# Altium schematic sheet Ucus_Kontrol_Bilgisayari.SchDoc: AZAK ROKET TAKIMI ÖZGÜN UÇUŞ KONTROL BİLGİSAYARI (part 4 of 4)
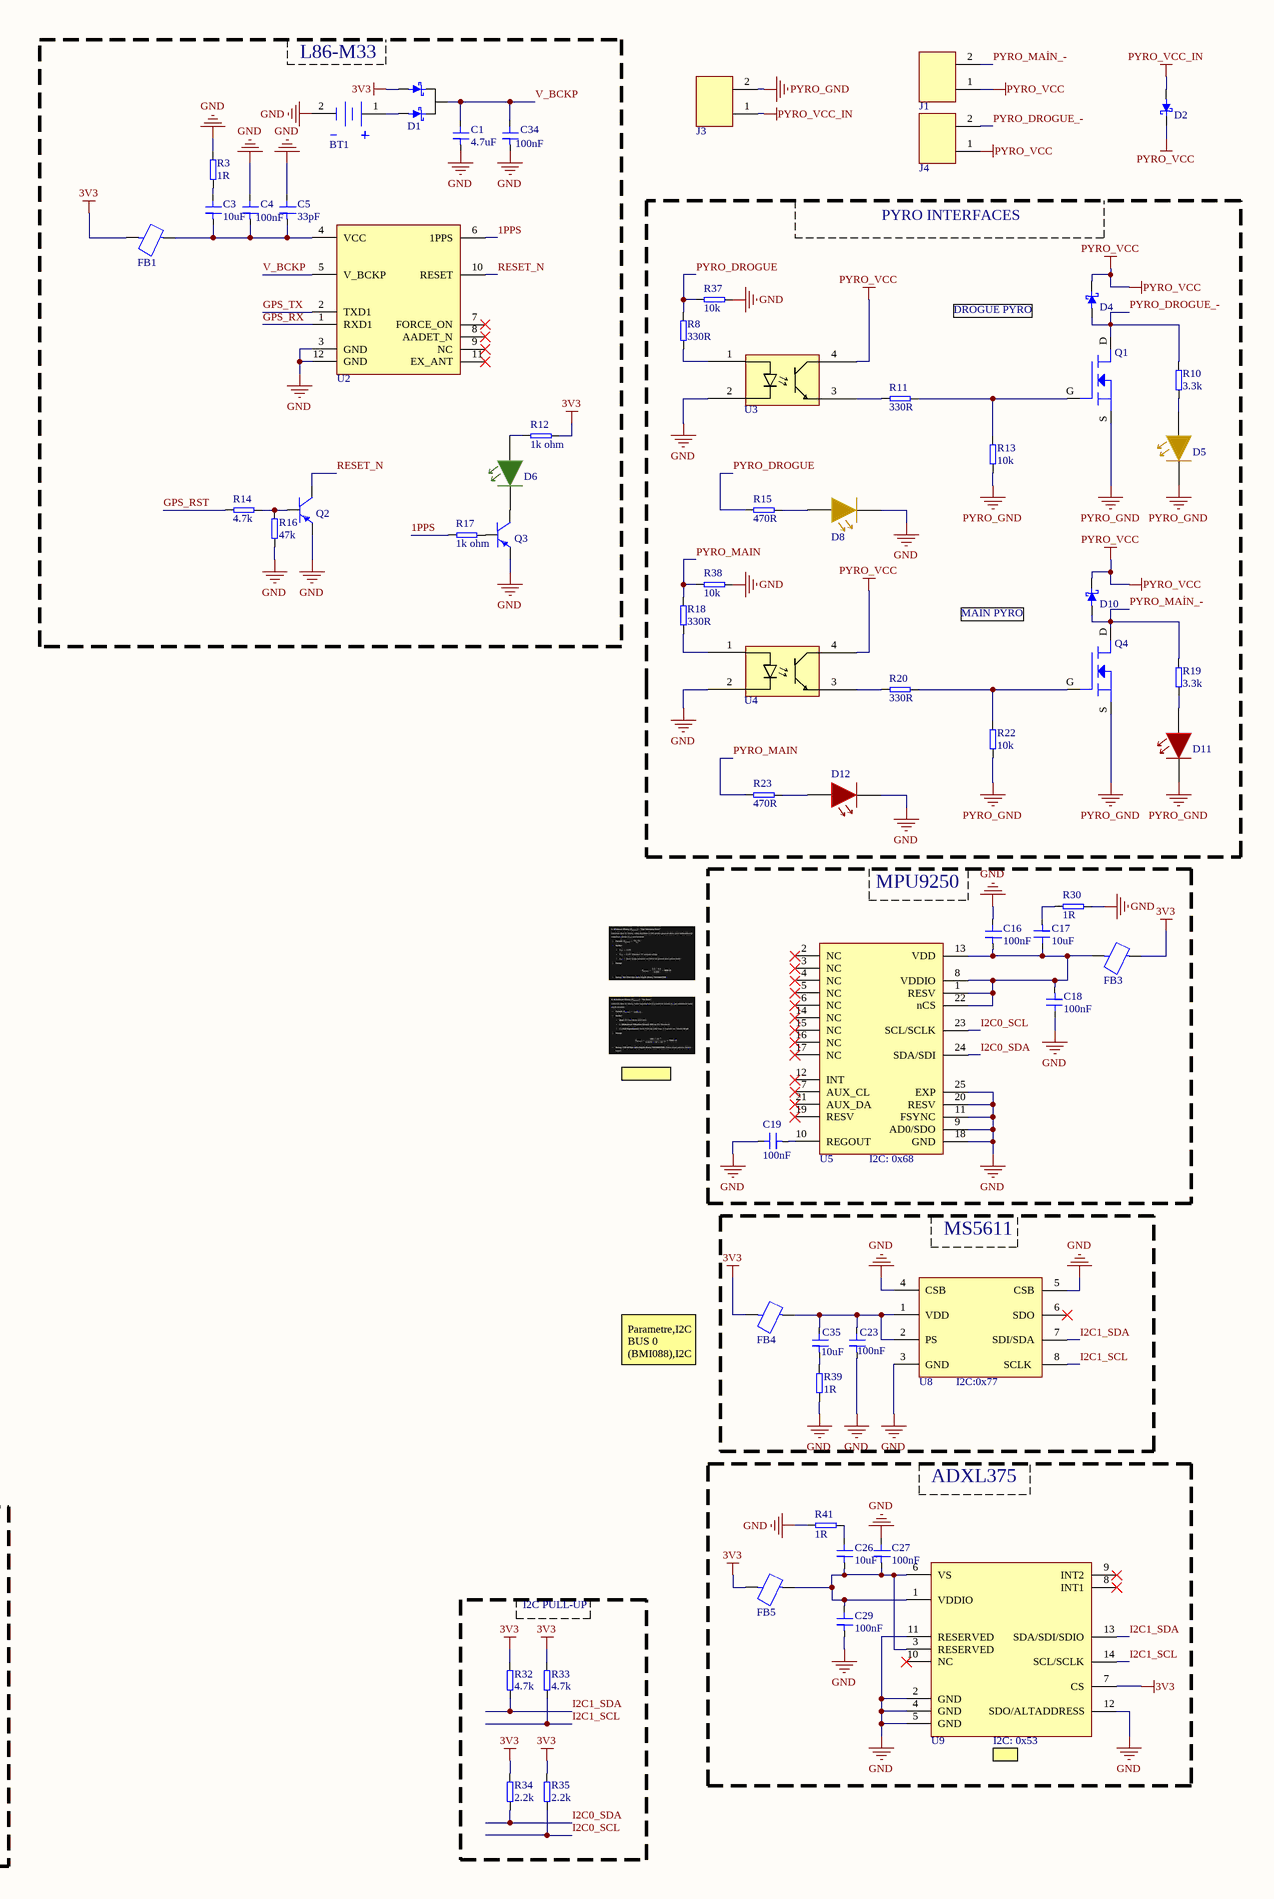
[diagram p4: Ucus_Kontrol_Bilgisayari.SchDoc, right]

## Library data of the parts (continued)
R14 R32 R33 = RES 4.7k Ohm %1 SMD 0603: Res Thick Film 1.6 x 0.8 mm 4.7K Ohm 1% 0.1W(1/10W) 100ppm/ C Molded SMD Paper T/R; Manufacturer: Yageo Group; Manufacturer Part Number: RC0603FR-074K7L; Power Dissipation: 100mW; Value: 4.7kΩ; Temperature Coefficient: 100ppm/°C; Voltage Rating: 75V; Voltage Rating (DC): 50V; Supplier: Mouser; Supplier Part Number: 603-RC0603FR-074K7L; RoHS: Compliant; Category: Chip SMD Resistors; Stock: 1189372; Pricing: 1=0,1, 10=0,009, 50=0,009, 100=0,008, 1000=0,006, 10000=0,002 (USD); Case/Package: 0603; Case Code (Imperial): 0603; China RoHS: Non-Compliant; Composition: Thick Film; Depth: 800µm; Height: 450µm; Lead Free: Lead Free; Lead Pitch: 300µm; Length: 1.6mm; Lifecycle Status: Production; Max Operating Temperature: 155°C; Military Standard: Not; Min Operating Temperature: -55°C; Mounting Technology: Surface Mount; Pins: 2; Number of Terminals: 2; Packaging: Tape & Reel; Power Rating: 100mW; REACH SVHC: Yes; Schedule B: 8533210045, 8533210045|8533210045|8533210045|8533210045|8533210045|8533210045|8533210045|8533210045|8533210045|8533210045|8533210045|8533210045|8533210045|8533210045|8533210045|8533210045|8533210045|8533210045|8533210045|8533210045|8533210045|8533210045|8533210045|85; Termination: SMD/SMT; Tolerance: 1%; Width: 800µm; Working Voltage: 75V; ComponentLink1URL: https://datasheet.octopart.com:443/RC0603FR-074K7L-Yageo-datasheet-175887523.pdf?src-supplier=IHS; ComponentLink1Description: https://datasheet.octopart.com:443/RC0603FR-074K7L-Yageo-datasheet-175887523.pdf?src-supplier=IHS; ComponentLink2URL: https://datasheet.octopart.com:443/RC0603FR-074K7L-Yageo-datasheet-103092701.pdf?src-supplier=Upverter; ComponentLink2Description: https://datasheet.octopart.com:443/RC0603FR-074K7L-Yageo-datasheet-103092701.pdf?src-supplier=Upverter; ComponentLink3URL: https://datasheet.octopart.com:443/RC0603FR-074K7L-Yageo-datasheet-8328172.pdf?src-supplier=Farnell; ComponentLink3Description: https://datasheet.octopart.com:443/RC0603FR-074K7L-Yageo-datasheet-8328172.pdf?src-supplier=Farnell; ComponentLink4URL: https://datasheet.octopart.com:443/RC0603FR-074K7L-Yageo-datasheet-13691069.pdf?src-supplier=Farnell; ComponentLink4Description: https://datasheet.octopart.com:443/RC0603FR-074K7L-Yageo-datasheet-13691069.pdf?src-supplier=Farnell; ComponentLink5URL: https://datasheet.octopart.com:443/RC0603FR-074K7L-Yageo-datasheet-175423674.pdf?src-supplier=Newark; ComponentLink5Description: https://datasheet.octopart.com:443/RC0603FR-074K7L-Yageo-datasheet-175423674.pdf?src-supplier=Newark; ComponentLink6URL: https://datasheet.octopart.com:443/RC0603FR-074K7L-Yageo-datasheet-12596169.pdf?src-supplier=Newark; ComponentLink6Description: https://datasheet.octopart.com:443/RC0603FR-074K7L-Yageo-datasheet-12596169.pdf?src-supplier=Newark; ComponentLink7URL: https://datasheet.octopart.com:443/RC0603FR-074K7L-Yageo-datasheet-503470.pdf?src-supplier=Newark; ComponentLink7Description: https://datasheet.octopart.com:443/RC0603FR-074K7L-Yageo-datasheet-503470.pdf?src-supplier=Newark; ComponentLink8URL: https://datasheet.octopart.com:443/RC0603FR-074K7L-Yageo-datasheet-34211833.pdf?src-supplier=element14+APAC; ComponentLink8Description: https://datasheet.octopart.com:443/RC0603FR-074K7L-Yageo-datasheet-34211833.pdf?src-supplier=element14+APAC; ComponentLink9URL: https://datasheet.octopart.com:443/RC0603FR-074K7L-Yageo-datasheet-62067350.pdf?src-supplier=element14+APAC; ComponentLink9Description: https://datasheet.octopart.com:443/RC0603FR-074K7L-Yageo-datasheet-62067350.pdf?src-supplier=element14+APAC; ComponentLink10URL: https://datasheet.octopart.com:443/RC0603FR-074K7L-Yageo-datasheet-17842380.pdf?src-supplier=element14+APAC; ComponentLink10Description: https://datasheet.octopart.com:443/RC0603FR-074K7L-Yageo-datasheet-17842380.pdf?src-supplier=element14+APAC; ComponentLink11URL: https://datasheet.octopart.com:443/RC0603FR-074K7L-Yageo-datasheet-164759695.pdf?src-supplier=Future+Electronics; ComponentLink11Description: https://datasheet.octopart.com:443/RC0603FR-074K7L-Yageo-datasheet-164759695.pdf?src-supplier=Future+Electronics; ComponentLink12URL: https://datasheet.octopart.com:443/RC0603FR-074K7L-Yageo-datasheet-137700087.pdf?src-supplier=Future+Electronics; ComponentLink12Description: https://datasheet.octopart.com:443/RC0603FR-074K7L-Yageo-datasheet-137700087.pdf?src-supplier=Future+Electronics; ComponentLink13URL: https://datasheet.octopart.com:443/RC0603FR074K7L-Yageo-datasheet-27584510.pdf?src-supplier=Future+Electronics; ComponentLink13Description: https://datasheet.octopart.com:443/RC0603FR074K7L-Yageo-datasheet-27584510.pdf?src-supplier=Future+Electronics; ComponentLink14URL: https://datasheet.octopart.com:443/RC0603FR-074K7L-Yageo-datasheet-15599030.pdf?src-supplier=Future+Electronics; ComponentLink14Description: https://datasheet.octopart.com:443/RC0603FR-074K7L-Yageo-datasheet-15599030.pdf?src-supplier=Future+Electronics; ComponentLink15URL: https://datasheet.octopart.com:443/RC0603FR-074K7L-Yageo-datasheet-79472498.pdf?src-supplier=Megastar; ComponentLink15Description: https://datasheet.octopart.com:443/RC0603FR-074K7L-Yageo-datasheet-79472498.pdf?src-supplier=Megastar; ComponentLink16URL: https://datasheet.octopart.com/RC0603FR-074K7L-Yageo-datasheet-73766026.pdf; ComponentLink16Description: https://datasheet.octopart.com/RC0603FR-074K7L-Yageo-datasheet-73766026.pdf; ComponentLink17URL: https://datasheet.octopart.com:443/RC0603FR-074K7L-Yageo-datasheet-118562.pdf?src-supplier=DigiKey; ComponentLink17Description: https://datasheet.octopart.com:443/RC0603FR-074K7L-Yageo-datasheet-118562.pdf?src-supplier=DigiKey; ComponentLink18URL: http://sigma.octopart.com:80/conflict_mineral_statement/Yageo-company-3.pdf?src-supplier=Compliance+Statements; ComponentLink18Description: http://sigma.octopart.com:80/conflict_mineral_statement/Yageo-company-3.pdf?src-supplier=Compliance+Statements; ComponentLink19URL: http://sigma.octopart.com:80/rohs_statement/Yageo-company-2.pdf?src-supplier=Compliance+Statements; ComponentLink19Description: http://sigma.octopart.com:80/rohs_statement/Yageo-company-2.pdf?src-supplier=Compliance+Statements; ComponentLink20Description: Tedarikçi; ComponentLink20URL: https://www.ozdisan.com/p/smt-smd-ve-cip-direncler-194/yageo-rc0603fr-074k7l-494590
R16 = RES 47k Ohm %5 SMD 0603: RES.(1608) 0603 47K Ohms 5% 1/10W-S 100PPM; Manufacturer: Royal Ohm; Manufacturer Part Number: 0603SAJ0473TDE; Supplier: Mouser; Supplier Part Number: 303-0603SAJ0473TDE; Category: Uncategorized; Pricing: 1=0,1, 10=0,006, 50=0,006, 100=0,003, 1000=0,002, 10000=0,001 (USD); ComponentLink1Description: Tedaarikçi; ComponentLink1URL: https://www.ozdisan.com/p/smt-smd-ve-cip-direncler-194/royalohm-0603saj0473tde-344193
R25 R26 = RES 5.1kOhm %1 SMD 0603: RES.(1608) 0603 5.1K Ohms 1% 1/10W-S 100PPM; Manufacturer: Royal Ohm; Manufacturer Part Number: 0603SAF5101T5E; Value: 5.1kΩ; Temperature Coefficient: 100ppm/°C; Supplier: Mouser; Supplier Part Number: 303-0603SAF5101T5E; Category: Uncategorized; Stock: 195000; Pricing: 10000=0,001 (USD); ComponentLink1URL: https://datasheet.octopart.com:443/0603SAF5101T5E-Royal-Ohm-datasheet-165785611.pdf?src-supplier=TME; ComponentLink1Description: https://datasheet.octopart.com:443/0603SAF5101T5E-Royal-Ohm-datasheet-165785611.pdf?src-supplier=TME; ComponentLink2URL: https://datasheet.octopart.com:443/0603SAF5101T5E-Royal-Ohm-datasheet-157855877.pdf?src-supplier=TME; ComponentLink2Description: https://datasheet.octopart.com:443/0603SAF5101T5E-Royal-Ohm-datasheet-157855877.pdf?src-supplier=TME; ComponentLink3URL: https://datasheet.octopart.com:443/0603SAF5101T5E-Royal-Ohm-datasheet-62069544.pdf?src-supplier=TME; ComponentLink3Description: https://datasheet.octopart.com:443/0603SAF5101T5E-Royal-Ohm-datasheet-62069544.pdf?src-supplier=TME; ComponentLink4URL: https://datasheet.octopart.com:443/0603SAF5101T5E-Royal-Ohm-datasheet-17591902.pdf?src-supplier=TME; ComponentLink4Description: https://datasheet.octopart.com:443/0603SAF5101T5E-Royal-Ohm-datasheet-17591902.pdf?src-supplier=TME; ComponentLink5Description: Tedarikçi; ComponentLink5URL: https://www.ozdisan.com/p/smt-smd-ve-cip-direncler-194/royalohm-0603saf5101t5e-352301
R28 R29 = RES 0R Ohms %1 SMD 0603: RES.(1608) 0603 0 Ohms 1% 1/10W; Manufacturer: VIKING; Manufacturer Part Number: CRT03F7-R0R0; Power Dissipation: 100mW; Value: 0Ω; Temperature Coefficient: 200ppm/°C; Voltage Rating: 50V; ComponentLink1Description: Tedarikçi; ComponentLink1URL: https://www.ozdisan.com/p/smt-smd-ve-cip-direncler-194/viking-crt03f7-r0r0-1077288; Supplier: Mouser; Supplier Part Number: CRT03F7-R0R0; RoHS: Compliant; Category: Chip SMD Resistors; Stock: 2093609; Pricing: 1=0,1, 1=0,086, 10=0,007, 10=0,006, 50=0,007, 100=0,005, 100=0,004, 1000=0,004, 1000=0,003, 5000=0,002, 10000=0,002 (USD); Case/Package: 0603; Case Code (Imperial): 0603; China RoHS: Non-Compliant; Composition: Thick Film; Contact Plating: Tin; Depth: 800µm; Height: 450µm; Lead Free: Lead Free; Length: 1.6mm; Lifecycle Status: Production; Max Operating Temperature: 155°C; Military Standard: Not; Min Operating Temperature: -55°C; Mounting Technology: Surface Mount; Pins: 2; Number of Terminals: 2; Packaging: Cut Tape; Power Rating: 100mW; Radiation Hardening: No; REACH SVHC: Yes; Termination: SMD/SMT; Tolerance: 1%; Voltage Rating (DC): 50V; Width: 800µm; ComponentLink2URL: https://datasheet.octopart.com:443/RC0603JR-070RL-Yageo-datasheet-182189538.pdf?src-supplier=IHS; ComponentLink2Description: https://datasheet.octopart.com:443/RC0603JR-070RL-Yageo-datasheet-182189538.pdf?src-supplier=IHS; ComponentLink3URL: https://datasheet.octopart.com:443/RC0603JR-070RL-Yageo-datasheet-8328172.pdf?src-supplier=element14+APAC; ComponentLink3Description: https://datasheet.octopart.com:443/RC0603JR-070RL-Yageo-datasheet-8328172.pdf?src-supplier=element14+APAC; ComponentLink4URL: https://datasheet.octopart.com:443/RC0603JR-070RL-Yageo-datasheet-17842380.pdf?src-supplier=element14+APAC; ComponentLink4Description: https://datasheet.octopart.com:443/RC0603JR-070RL-Yageo-datasheet-17842380.pdf?src-supplier=element14+APAC; ComponentLink5URL: https://datasheet.octopart.com:443/RC0603JR-070RL-Yageo-datasheet-62067350.pdf?src-supplier=Farnell; ComponentLink5Description: https://datasheet.octopart.com:443/RC0603JR-070RL-Yageo-datasheet-62067350.pdf?src-supplier=Farnell; ComponentLink6URL: https://datasheet.octopart.com:443/RC0603JR-070RL-Yageo-datasheet-15599030.pdf?src-supplier=Future+Electronics; ComponentLink6Description: https://datasheet.octopart.com:443/RC0603JR-070RL-Yageo-datasheet-15599030.pdf?src-supplier=Future+Electronics; ComponentLink7URL: https://datasheet.octopart.com:443/RC0603JR-070RL-Yageo-datasheet-164759695.pdf?src-supplier=Future+Electronics; ComponentLink7Description: https://datasheet.octopart.com:443/RC0603JR-070RL-Yageo-datasheet-164759695.pdf?src-supplier=Future+Electronics; ComponentLink8URL: https://datasheet.octopart.com:443/RC0603JR-070RL-Yageo-datasheet-137700087.pdf?src-supplier=Future+Electronics; ComponentLink8Description: https://datasheet.octopart.com:443/RC0603JR-070RL-Yageo-datasheet-137700087.pdf?src-supplier=Future+Electronics; ComponentLink9URL: https://datasheet.octopart.com:443/RC0603JR-070RL-Yageo-datasheet-27584510.pdf?src-supplier=Future+Electronics; ComponentLink9Description: https://datasheet.octopart.com:443/RC0603JR-070RL-Yageo-datasheet-27584510.pdf?src-supplier=Future+Electronics; ComponentLink10URL: https://datasheet.octopart.com:443/RC0603JR-070RL-Yageo-datasheet-503470.pdf?src-supplier=Future+Electronics; ComponentLink10Description: https://datasheet.octopart.com:443/RC0603JR-070RL-Yageo-datasheet-503470.pdf?src-supplier=Future+Electronics; ComponentLink11URL: https://datasheet.octopart.com:443/RC0603JR-070RL-Yageo-datasheet-12596169.pdf?src-supplier=Newark; ComponentLink11Description: https://datasheet.octopart.com:443/RC0603JR-070RL-Yageo-datasheet-12596169.pdf?src-supplier=Newark; ComponentLink12URL: https://datasheet.octopart.com:443/RC0603JR-070RL-Yageo-datasheet-34211833.pdf?src-supplier=Newark; ComponentLink12Description: https://datasheet.octopart.com:443/RC0603JR-070RL-Yageo-datasheet-34211833.pdf?src-supplier=Newark; ComponentLink13URL: https://datasheet.octopart.com:443/RC0603JR-070RL-Yageo-datasheet-79472498.pdf?src-supplier=Megastar; ComponentLink13Description: https://datasheet.octopart.com:443/RC0603JR-070RL-Yageo-datasheet-79472498.pdf?src-supplier=Megastar; ComponentLink14URL: https://datasheet.octopart.com/RC0603JR-070RL-Yageo-datasheet-73766026.pdf; ComponentLink14Description: https://datasheet.octopart.com/RC0603JR-070RL-Yageo-datasheet-73766026.pdf; ComponentLink15URL: https://datasheet.octopart.com:443/RC0603JR-070RL-Yageo-datasheet-5393049.pdf?src-supplier=element14; ComponentLink15Description: https://datasheet.octopart.com:443/RC0603JR-070RL-Yageo-datasheet-5393049.pdf?src-supplier=element14; ComponentLink16URL: https://datasheet.octopart.com:443/RC0603JR-070RL-Yageo-datasheet-118562.pdf?src-supplier=DigiKey; ComponentLink16Description: https://datasheet.octopart.com:443/RC0603JR-070RL-Yageo-datasheet-118562.pdf?src-supplier=DigiKey; ComponentLink17URL: http://sigma.octopart.com:80/conflict_mineral_statement/Yageo-company-3.pdf?src-supplier=Compliance+Statements; ComponentLink17Description: http://sigma.octopart.com:80/conflict_mineral_statement/Yageo-company-3.pdf?src-supplier=Compliance+Statements; ComponentLink18URL: http://sigma.octopart.com:80/rohs_statement/Yageo-company-2.pdf?src-supplier=Compliance+Statements; ComponentLink18Description: http://sigma.octopart.com:80/rohs_statement/Yageo-company-2.pdf?src-supplier=Compliance+Statements
R34 R35 = RES 2.2k Ohm %1 SMD 0603: Res Thick Film 0603 2.2K Ohm 1% 0.1W(1/10W) +/-100ppm/C Epoxy Pad SMD T/R; Manufacturer: Yageo Group; Manufacturer Part Number: RC0603FR-072K2L; Max Power Dissipation: 100mW; Value: 2.2kΩ; Temperature Coefficient: 100ppm/°C; Voltage Rating: 75V; Voltage Rating (DC): 50V; Supplier: Mouser; Supplier Part Number: 603-RC0603FR-072K2L; RoHS: Compliant; Category: Chip SMD Resistors; Stock: 1388232; Pricing: 1=0,1, 10=0,007, 50=0,007, 100=0,006, 1000=0,006, 10000=0,002 (USD); Case/Package: 0603; Case Code (Imperial): 0603; Case Code (Metric): 0603; China RoHS: Non-Compliant; Composition: Thick Film; Depth: 800µm; Features: Moisture Resistant; Height: 450µm; Lead Free: Lead Free; Length: 1.6mm; Lifecycle Status: Production; Max Operating Temperature: 155°C; Military Standard: Not; Min Operating Temperature: -55°C; Mounting Technology: Surface Mount; Pins: 2; Number of Terminals: 2; Number of Terminations: 2; Packaging: Tape & Reel; Power Dissipation: 100mW; Power Rating: 100mW; REACH SVHC: Yes; Schedule B: 8533210045, 8533210045|8533210045|8533210045|8533210045|8533210045|8533210045|8533210045|8533210045|8533210045|8533210045|8533210045|8533210045|8533210045|8533210045|8533210045, 8533210045|8533210045|8533210045|8533210045|8533210045|8533210045|8533210045|8533210045|8533210045|8533210045|8533210045|8533210045|8533210045|8533210045|8533210045|8533210045, 8533210045|8533210045|8533210045|8533210045|8533210045|8533210045|8533210045|8533210045|8533210045|8533210045|8533210045|8533210045|8533210045|8533210045|8533210045|8533210045|8533210045; Termination: SMD/SMT; Tolerance: 1%; Width: 800µm; Working Voltage: 75V; ComponentLink1URL: https://datasheet.octopart.com:443/RC0603FR-072K2L-Yageo-datasheet-175887523.pdf?src-supplier=IHS; ComponentLink1Description: https://datasheet.octopart.com:443/RC0603FR-072K2L-Yageo-datasheet-175887523.pdf?src-supplier=IHS; ComponentLink2URL: https://datasheet.octopart.com:443/RC0603FR-072K2L-Yageo-datasheet-103092701.pdf?src-supplier=Upverter; ComponentLink2Description: https://datasheet.octopart.com:443/RC0603FR-072K2L-Yageo-datasheet-103092701.pdf?src-supplier=Upverter; ComponentLink3URL: https://datasheet.octopart.com:443/RC0603FR-072K2L-Yageo-datasheet-8328172.pdf?src-supplier=Newark; ComponentLink3Description: https://datasheet.octopart.com:443/RC0603FR-072K2L-Yageo-datasheet-8328172.pdf?src-supplier=Newark; ComponentLink4URL: https://datasheet.octopart.com:443/RC0603FR-072K2L-Yageo-datasheet-12596169.pdf?src-supplier=Newark; ComponentLink4Description: https://datasheet.octopart.com:443/RC0603FR-072K2L-Yageo-datasheet-12596169.pdf?src-supplier=Newark; ComponentLink5URL: https://datasheet.octopart.com:443/RC0603FR-072K2L-Yageo-datasheet-13691069.pdf?src-supplier=Newark; ComponentLink5Description: https://datasheet.octopart.com:443/RC0603FR-072K2L-Yageo-datasheet-13691069.pdf?src-supplier=Newark; ComponentLink6URL: https://datasheet.octopart.com:443/RC0603FR-072K2L-Yageo-datasheet-34211833.pdf?src-supplier=element14+APAC; ComponentLink6Description: https://datasheet.octopart.com:443/RC0603FR-072K2L-Yageo-datasheet-34211833.pdf?src-supplier=element14+APAC; ComponentLink7URL: https://datasheet.octopart.com:443/RC0603FR-072K2L-Yageo-datasheet-62067350.pdf?src-supplier=element14+APAC; ComponentLink7Description: https://datasheet.octopart.com:443/RC0603FR-072K2L-Yageo-datasheet-62067350.pdf?src-supplier=element14+APAC; ComponentLink8URL: https://datasheet.octopart.com:443/RC0603FR-072K2L-Yageo-datasheet-17842380.pdf?src-supplier=element14+APAC; ComponentLink8Description: https://datasheet.octopart.com:443/RC0603FR-072K2L-Yageo-datasheet-17842380.pdf?src-supplier=element14+APAC; ComponentLink9URL: https://datasheet.octopart.com:443/RC0603FR-072K2L-Yageo-datasheet-21426514.pdf?src-supplier=element14+APAC; ComponentLink9Description: https://datasheet.octopart.com:443/RC0603FR-072K2L-Yageo-datasheet-21426514.pdf?src-supplier=element14+APAC; ComponentLink10URL: https://datasheet.octopart.com:443/RC0603FR-072K2L-Yageo-datasheet-164759695.pdf?src-supplier=Future+Electronics; ComponentLink10Description: https://datasheet.octopart.com:443/RC0603FR-072K2L-Yageo-datasheet-164759695.pdf?src-supplier=Future+Electronics; ComponentLink11URL: https://datasheet.octopart.com:443/RC0603FR-072K2L-Yageo-datasheet-137700087.pdf?src-supplier=Future+Electronics; ComponentLink11Description: https://datasheet.octopart.com:443/RC0603FR-072K2L-Yageo-datasheet-137700087.pdf?src-supplier=Future+Electronics; ComponentLink12URL: https://datasheet.octopart.com:443/RC0603FR-072K2L-Yageo-datasheet-27584510.pdf?src-supplier=Future+Electronics; ComponentLink12Description: https://datasheet.octopart.com:443/RC0603FR-072K2L-Yageo-datasheet-27584510.pdf?src-supplier=Future+Electronics; ComponentLink13URL: https://datasheet.octopart.com:443/RC0603FR-072K2L-Yageo-datasheet-15599030.pdf?src-supplier=Future+Electronics; ComponentLink13Description: https://datasheet.octopart.com:443/RC0603FR-072K2L-Yageo-datasheet-15599030.pdf?src-supplier=Future+Electronics; ComponentLink14URL: https://datasheet.octopart.com:443/RC0603FR-072K2L-Yageo-datasheet-8324193.pdf?src-supplier=Future+Electronics; ComponentLink14Description: https://datasheet.octopart.com:443/RC0603FR-072K2L-Yageo-datasheet-8324193.pdf?src-supplier=Future+Electronics; ComponentLink15URL: https://datasheet.octopart.com:443/RC0603FR-072K2L-Yageo-datasheet-79472498.pdf?src-supplier=Megastar; ComponentLink15Description: https://datasheet.octopart.com:443/RC0603FR-072K2L-Yageo-datasheet-79472498.pdf?src-supplier=Megastar; ComponentLink16URL: https://datasheet.octopart.com/RC0603FR-072K2L-Yageo-datasheet-73766026.pdf; ComponentLink16Description: https://datasheet.octopart.com/RC0603FR-072K2L-Yageo-datasheet-73766026.pdf; ComponentLink17URL: https://datasheet.octopart.com:443/RC0603FR-072K2L-Yageo-datasheet-118562.pdf?src-supplier=DigiKey; ComponentLink17Description: https://datasheet.octopart.com:443/RC0603FR-072K2L-Yageo-datasheet-118562.pdf?src-supplier=DigiKey; ComponentLink18URL: https://datasheet.octopart.com:443/RC0603FR-072K2L-Yageo-datasheet-499455.pdf?src-supplier=element14; ComponentLink18Description: https://datasheet.octopart.com:443/RC0603FR-072K2L-Yageo-datasheet-499455.pdf?src-supplier=element14; ComponentLink19URL: http://sigma.octopart.com:80/conflict_mineral_statement/Yageo-company-3.pdf?src-supplier=Compliance+Statements; ComponentLink19Description: http://sigma.octopart.com:80/conflict_mineral_statement/Yageo-company-3.pdf?src-supplier=Compliance+Statements; ComponentLink20URL: http://sigma.octopart.com:80/rohs_statement/Yageo-company-2.pdf?src-supplier=Compliance+Statements; ComponentLink20Description: http://sigma.octopart.com:80/rohs_statement/Yageo-company-2.pdf?src-supplier=Compliance+Statements
SW1 SW2 = L-KLS7-TS3611-2.5-180-T: Boyut: 3.65x6.1x2.5mm; Akım Değeri (DC): 50 mA; Voltaj Değeri (DC): 12 V; ComponentLink1Description: Tedarikçi; ComponentLink1URL: https://www.ozdisan.com/p/tact-sivicler-485/kls-electronic-l-kls7-ts3611-2-5-180-t-466204?srsltid=AfmBOorFLjm9ymzcBd8UOG7X3jKp1KxBP6-EelnuiW7FwuRcnv0FOZ8-&=tact-sivicler-485&=kls-electronic-l-kls7-ts3611-2-5-180-t-466204; Part Number: L-KLS7-TS3611-2.5-180-T; Çalıştırma Kuvveti: 180 gF
U1 = AP64500SP-13: 3.8V to 40V Input 5A Low IQ Synchronous Buck Converter with Programmable Frequency 8-Pin SOIC EP T/R; Manufacturer: Diodes Inc.; Max Switching Frequency: 2.2MHz; Min Output Voltage: 800mV; Nominal Supply Voltage: 12V; Number of Circuits: 1; Supplier: Mouser; Supplier Part Number: 621-AP64500SP-13; Manufacturer Part Number: AP64500SP-13; RoHS: Compliant; Category: Voltage Regulators - Switching; Stock: 11720; Pricing: 1=2,09, 10=1,55, 50=1,41, 100=1,26, 1000=1,11, 10000=1,11 (USD); China RoHS: Compliant; Height - Seated (Max): 1.63mm; Length: 4.9mm; Lifecycle Status: Production; Max Supply Voltage: 40V; Max Operating Temperature: 85°C; Max Output current: 5A; Max Output Voltage: 40V; Min Input Voltage: 3.8V; Min Operating Temperature: -40°C; Number of Terminals: 8; REACH SVHC: Yes; Schedule B: 8542390000, 8542390000|8542390000|8542390000|8542390000|8542390000; Terminal Pitch: 1.27mm; Topology: Buck; Width: 3.9mm; ComponentLink1URL: https://datasheet.octopart.com:443/AP64500SP-13-Diodes-Inc.-datasheet-149521345.pdf?src-supplier=IHS; ComponentLink1Description: https://datasheet.octopart.com:443/AP64500SP-13-Diodes-Inc.-datasheet-149521345.pdf?src-supplier=IHS; ComponentLink2URL: https://datasheet.octopart.com:443/AP64500SP-13-Diodes-Inc.-datasheet-145012329.pdf?src-supplier=Diodes+Inc+SCT; ComponentLink2Description: https://datasheet.octopart.com:443/AP64500SP-13-Diodes-Inc.-datasheet-145012329.pdf?src-supplier=Diodes+Inc+SCT; ComponentLink3URL: https://sigma.octopart.com:443/138896280/technical_drawing/Diodes-Inc.-AP64500SP-13.pdf?src-supplier=Diodes+Inc+SCT; ComponentLink3Description: https://sigma.octopart.com:443/138896280/technical_drawing/Diodes-Inc.-AP64500SP-13.pdf?src-supplier=Diodes+Inc+SCT; ComponentLink4Description: Tedarikçi; ComponentLink4URL: https://www.e-komponent.com/buck-switching-regulator-ic-ap64500sp-13
U2 = L86-M33: GLONASS/GPS/QZSS Module 18, 4x18, 4x6, 4mm SMD w/Antenna L86-M33; Manufacturer: Quectel Wireless Solutions; Designed by: Eren/Mehmet; Supplier: Mouser; Supplier Part Number: 277-L86-M33; Manufacturer Part Number: L86-M33; RoHS: Yes; Category: Connectors; Stock: 3077; Pricing: 1=15,26, 10=11,88, 50=10,54, 100=9,69, 1000=8,44, 10000=8,44 (USD); ComponentLink1URL: http://www.quectel.com/UploadFile/Product/Quectel_L86_GNSS_Specification_V1.0.pdf?src-supplier=Avnet; ComponentLink1Description: http://www.quectel.com/UploadFile/Product/Quectel_L86_GNSS_Specification_V1.0.pdf?src-supplier=Avnet; ComponentLink2URL: https://datasheet.octopart.com/L86-M33-Quectel-datasheet-163887215.pdf?src-supplier=SOS+electronic; ComponentLink2Description: https://datasheet.octopart.com/L86-M33-Quectel-datasheet-163887215.pdf?src-supplier=SOS+electronic
U3 U4 = LTV-816S-TA1-C: Transistor Output Optocoupler, 1-Element, 5000V Isolation; Manufacturer: Lite-On; Collector Emitter Breakdown Voltage: 80V; Current Transfer Ratio: 200%; Dark Current: 100nA; Forward Current: 50mA; Forward Voltage: 1.4V; Isolation Voltage: 5kV; Max Power Dissipation: 150mW; Number of Elements: 1; Supplier: Mouser; Supplier Part Number: 859-LTV-816S-TA1-C; Manufacturer Part Number: LTV-816S-TA1-C; RoHS: Compliant; Category: Optocouplers; Stock: 2386; Pricing: 1=0,39, 10=0,265, 50=0,265, 100=0,189, 1000=0,135, 10000=0,103 (USD); China RoHS: Compliant; Lifecycle Status: Production; Max Operating Temperature: 110°C; Min Operating Temperature: -30°C; Mounting Technology: Surface Mount; REACH SVHC: Yes; Schedule B: 8541408000, 8541408000|8541408000|8541408000|8541408000|8541408000; ComponentLink1URL: https://datasheet.octopart.com:443/LTV-816S-TA1-C-Lite-On-datasheet-147640660.pdf?src-supplier=IHS; ComponentLink1Description: https://datasheet.octopart.com:443/LTV-816S-TA1-C-Lite-On-datasheet-147640660.pdf?src-supplier=IHS; ComponentLink2URL: https://datasheet.octopart.com:443/LTV-816S-TA1-C-Lite-On-datasheet-136482132.pdf?src-supplier=Future+Electronics; ComponentLink2Description: https://datasheet.octopart.com:443/LTV-816S-TA1-C-Lite-On-datasheet-136482132.pdf?src-supplier=Future+Electronics; ComponentLink3Description: Tedarikçi; ComponentLink3URL: https://www.ozdisan.com/p/transistor-ve-fotovoltaik-cikisli-optokuplorler-189/liteon-ltv-816s-ta1-c-359059
U5 = MPU9250: Accelerometer, Gyroscope, Magnetometer, 9 Axis Sensor I2C, SPI Output; Supplier Device Package: 24-QFN (3x3); Package / Case: 24-TFQFN Module Exposed Pad; Operating Temperature: -40°C ~ 85°C; Output Type: I2C, SPI; Sensor Type: Accelerometer, Gyroscope, Magnetometer, 9 Axis
U6 = ESP32-S3-WROOM-1U-N16R8: Module; Wi-Fi/Bluetooth; transceiver; 16MB FLASH/8MB PSRAM/512KB SRAM/384KB ROM; 3.0-3.6V; 18x25.5x3.2mm; Manufacturer: Espressif Systems; Max Supply Voltage: 3.6V; Min Supply Voltage: 3V; Operating Supply Voltage: 3.3V; Supplier: Mouser; Supplier Part Number: 356-ESP32S3WM1UN16R8; Manufacturer Part Number: ESP32-S3-WROOM-1U-N16R8; RoHS: Compliant; Category: RF Transceiver Modules and Modems; Stock: 12610; Pricing: 1=6,56, 1=5,64, 10=5,69, 10=4,89, 25=4,63, 50=5,38, 100=4,96, 100=4,27, 250=4,04, 500=3,35, 1000=3,89, 10000=3,89 (USD); Height - Seated (Max): 3.35mm; Length: 19.2mm; Max Operating Temperature: 65°C; Min Operating Temperature: -40°C; Number of Terminals: 41; REACH SVHC: Yes; Terminal Pitch: 1.27mm; Width: 18mm; ComponentLink1URL: https://datasheet.octopart.com:443/ESP32-S3-WROOM-1U-N16R8-Espressif-Systems-datasheet-165560563.pdf?src-supplier=IHS; ComponentLink1Description: https://datasheet.octopart.com:443/ESP32-S3-WROOM-1U-N16R8-Espressif-Systems-datasheet-165560563.pdf?src-supplier=IHS; ComponentLink2URL: https://datasheet.octopart.com:443/ESP32-S3-WROOM-1U-N16R8-Espressif-Systems-datasheet-188867343.pdf?src-supplier=TME; ComponentLink2Description: https://datasheet.octopart.com:443/ESP32-S3-WROOM-1U-N16R8-Espressif-Systems-datasheet-188867343.pdf?src-supplier=TME; ComponentLink3URL: https://datasheet.octopart.com:443/ESP32-S3-WROOM-1U-N16R8-Espressif-Systems-datasheet-165560559.pdf?src-supplier=TME; ComponentLink3Description: https://datasheet.octopart.com:443/ESP32-S3-WROOM-1U-N16R8-Espressif-Systems-datasheet-165560559.pdf?src-supplier=TME; ComponentLink4Description: Tedarikçi; ComponentLink4URL: https://www.e-komponent.com/esp32-s3-wroom-1u-n16r8-transceiver-module
U7 = USBLC6-2SC6: STMicroelectronics USBLC6-2SC6 TVS diode surge protection on full tape reel; Breakdown Voltage: 6V; Value: 2.5pF; Clamping Voltage: 17V; Data Rate: 480Mbps; Direction: Unidirectional; Element Configuration: Dual; ESD Protection: Yes; Forward Voltage: 1.1V; Leakage Current: 150nA; Max Junction Temperature (Tj): 125°C; Max Repetitive Reverse Voltage (Vrrm): 5.25V; Number of Bidirectional Channels: 2; Number of Elements: 1; Peak Pulse Current: 5A; Reverse Standoff Voltage: 5V; Test Current: 1mA; Supplier: Mouser; Supplier Part Number: 511-USBLC6-2SC6; Manufacturer: STMicroelectronics; Manufacturer Part Number: USBLC6-2SC6; RoHS: Compliant; Category: TVS Diodes; Stock: 219137; Pricing: 1=0,36, 1=0,31, 10=0,243, 10=0,209, 50=0,243, 100=0,163, 100=0,14, 500=0,109, 1000=0,114, 1000=0,098, 3000=0,068, 10000=0,075 (USD); Case/Package: SOT-23; China RoHS: Compliant; Contact Plating: Tin; Depth: 1.75mm; Height: 1.45mm; Lead Free: Lead Free; Length: 3.05mm; Lifecycle Status: Production; Max Breakdown Voltage: 6V; Max Operating Temperature: 125°C; Max Reverse Leakage Current: 150nA; Min Breakdown Voltage: 6V; Min Operating Temperature: -40°C; Mounting Technology: Surface Mount; Number of Channels: 2; Pins: 6; Number of Terminals: 6; Operating Supply Voltage: 1.1V; Peak Reverse Current: 150nA; Polarity: Unidirectional; Power Line Protection: Yes; Radiation Hardening: No; REACH SVHC: Yes; Reverse Breakdown Voltage: 6V; Schedule B: 8536300000, 8536300000|8536300000|8536300000|8536300000|8536300000|8536300000|8536300000|8536300000|8536300000|8536300000|8536300000|8536300000|8536300000|8536300000|8536300000|8536300000|8536300000|8536300000|8536300000|8536300000|8536300000|8536300000|8536300000|85; Termination: SMD/SMT; Width: 1.75mm; Working Voltage: 5V; ComponentLink1URL: https://datasheet.octopart.com:443/USBLC6-2SC6-STMicroelectronics-datasheet-10412581.pdf?src-supplier=Newark; ComponentLink1Description: https://datasheet.octopart.com:443/USBLC6-2SC6-STMicroelectronics-datasheet-10412581.pdf?src-supplier=Newark; ComponentLink2URL: https://datasheet.octopart.com:443/USBLC6-2SC6-STMicroelectronics-datasheet-181961833.pdf?src-supplier=Newark; ComponentLink2Description: https://datasheet.octopart.com:443/USBLC6-2SC6-STMicroelectronics-datasheet-181961833.pdf?src-supplier=Newark; ComponentLink3URL: https://datasheet.octopart.com:443/USBLC6-2SC6-STMicroelectronics-datasheet-525477.pdf?src-supplier=Factory+Futures; ComponentLink3Description: https://datasheet.octopart.com:443/USBLC6-2SC6-STMicroelectronics-datasheet-525477.pdf?src-supplier=Factory+Futures; ComponentLink4URL: https://datasheet.octopart.com:443/USBLC6-2SC6-STMicroelectronics-datasheet-82998616.pdf?src-supplier=Farnell; ComponentLink4Description: https://datasheet.octopart.com:443/USBLC6-2SC6-STMicroelectronics-datasheet-82998616.pdf?src-supplier=Farnell; ComponentLink5URL: https://datasheet.octopart.com:443/USBLC6-2SC6-STMicroelectronics-datasheet-46285.pdf?src-supplier=Farnell; ComponentLink5Description: https://datasheet.octopart.com:443/USBLC6-2SC6-STMicroelectronics-datasheet-46285.pdf?src-supplier=Farnell; ComponentLink6URL: https://datasheet.octopart.com:443/USBLC6-2SC6-STMicroelectronics-datasheet-14050643.pdf?src-supplier=iiiC; ComponentLink6Description: https://datasheet.octopart.com:443/USBLC6-2SC6-STMicroelectronics-datasheet-14050643.pdf?src-supplier=iiiC; ComponentLink7URL: https://datasheet.octopart.com:443/USBLC6-2SC6-STMicroelectronics-datasheet-10521292.pdf?src-supplier=Jameco; ComponentLink7Description: https://datasheet.octopart.com:443/USBLC6-2SC6-STMicroelectronics-datasheet-10521292.pdf?src-supplier=Jameco; ComponentLink8Description: Tedarikçi; ComponentLink8URL: https://www.ozdisan.com/p/tvs-diyotlar-386/stm-usblc6-2sc6-402751
U8 = MS5611: Pressure Sensor 1.44V to 3.6V 0.01bar to 1.2bar Absolute 8-Pin QFN T/R; Manufacturer: TE Connectivity; Manufacturer Part Number: MS561101BA03-50; Designed by: Eren/Mehmet; Output Type: SPI,I2C; Operating Pressure: 17.4PSI; Port Style: No Port; Max Pressure: 87.02PSI; ComponentLink1URL: http://www.farnell.com/datasheets/2917208.pdf?src-supplier=Farnell; ComponentLink1Description: http://www.farnell.com/datasheets/2917208.pdf?src-supplier=Farnell; ComponentLink2URL: http://www.farnell.com/datasheets/1756128.pdf?src-supplier=Newark; ComponentLink2Description: http://www.farnell.com/datasheets/1756128.pdf?src-supplier=Newark; ComponentLink3URL: https://www.te.com/commerce/DocumentDelivery/DDEController?Action=srchrtrv&DocNm=MS5611-01BA03&DocType=Data+Sheet&DocLang=English&src-supplier=Digikey; ComponentLink3Description: https://www.te.com/commerce/DocumentDelivery/DDEController?Action=srchrtrv&DocNm=MS5611-01BA03&DocType=Data+Sheet&DocLang=English&src-supplier=Digikey; ComponentLink4URL: https://datasheet.octopart.com/MS561101BA03-50-TE-Connectivity-datasheet-21074432.pdf?src-supplier=Element14; ComponentLink4Description: https://datasheet.octopart.com/MS561101BA03-50-TE-Connectivity-datasheet-21074432.pdf?src-supplier=Element14; ComponentLink5URL: https://datasheet.octopart.com/MS561101BA03-50-TE-Connectivity-datasheet-65793092.pdf?src-supplier=Future+Electronics; ComponentLink5Description: https://datasheet.octopart.com/MS561101BA03-50-TE-Connectivity-datasheet-65793092.pdf?src-supplier=Future+Electronics; ComponentLink6URL: https://datasheet.octopart.com/MS561101BA03-50-TE-Connectivity-datasheet-134530980.pdf?src-supplier=Master+Electronics; ComponentLink6Description: https://datasheet.octopart.com/MS561101BA03-50-TE-Connectivity-datasheet-134530980.pdf?src-supplier=Master+Electronics; Supplier: Mouser; Supplier Part Number: 824-MS561101BA03-50; RoHS: Yes; Category: Linear ICs; Pricing: 1=9,36, 10=8,23, 50=7,39, 100=6,27, 1000=5,83, 10000=5,78 (USD); Case/Package: SMD/SMT; Pins: 8; Min Operating Temperature: -40°C; Max Operating Temperature: 85°C; Operating Supply Voltage: 3.6V; Pressure Type: Absolute; Termination: SMD/SMT; Series: -; Packaging: Cut Tape; RoHS Compliant: Yes
U9 = ADXL375: 3-Axis, ±200 g Digital MEMS Accelerometer; Manufacturer: Analog Devices; Manufacturer Part Number: ADXL375BCCZ-RL7; Manufacturer Lifecycle Status: PRODUCTION; Axis: X, Y, Z; Bandwidth: 1kHz; Interface: I2C, SPI; Max Supply Voltage: 3.6V; Min Supply Voltage: 2V; Nominal Supply Current: 145µA; Supplier: Mouser; Supplier Part Number: 584-ADXL375BCCZ-RL7; RoHS: Compliant; Category: Accelerometers; Stock: 1898; Pricing: 1=12,41, 10=10,84, 50=9,98, 100=9,71, 1000=8,53, 10000=8,53 (USD); -3db Bandwidth: 1.6kHz; Height: 1mm; Lead Free: Contains Lead; Lifecycle Status: Production; Max Operating Temperature: 85°C; Min Operating Temperature: -40°C; Mounting Technology: Surface Mount; Pins: 14; Operating Supply Current: 145µA; Operating Supply Voltage: 3.6V; Output Type: Digital; Schedule B: 9031808080, 9031808080|9031808080, 9031808080|9031808080|9031808080, 9031808080|9031808080|9031808080|9031808080; ComponentLink1URL: https://datasheet.octopart.com:443/ADXL375BCCZ-RL7-Analog-Devices-datasheet-25360144.pdf?src-supplier=Upverter; ComponentLink1Description: https://datasheet.octopart.com:443/ADXL375BCCZ-RL7-Analog-Devices-datasheet-25360144.pdf?src-supplier=Upverter; ComponentLink2URL: https://sigma.octopart.com:443/160772067/technical_drawing/Analog-Devices-ADXL375BCCZ-RL7.pdf?src-supplier=Upverter; ComponentLink2Description: https://sigma.octopart.com:443/160772067/technical_drawing/Analog-Devices-ADXL375BCCZ-RL7.pdf?src-supplier=Upverter; ComponentLink3URL: https://octopart.com:443/opatz8j6/c1?t=y9lmieeWgZ9elonZMqrXmIgn_IZsCVo8rtjxFU3VdZOR9Mubp89NzcM6__QsSLf8-dk5RRem-joszf8SEqvilfxrCB11iJqw5X9Arqhy7foRDbxp7StnTURm-tdV4woioiKila_JmxNohQ1lxyaA81AyhAik26ysYEZVEJpWSThFjz-NCDmBVt5X3tIH7dM-gI1NAsoDzk0W8AgdiDQWEwn1k__uj5AtHdVkFjPmsxReUFzEGPjBJUFrTTW1zOLQllgZJ-oCJB7k7FVN_YjP1V3N53E_3ZgpfR7hpYibbar93OxYLElSpA&src-supplier=Analog+Devices; ComponentLink3Description: https://octopart.com:443/opatz8j6/c1?t=y9lmieeWgZ9elonZMqrXmIgn_IZsCVo8rtjxFU3VdZOR9Mubp89NzcM6__QsSLf8-dk5RRem-joszf8SEqvilfxrCB11iJqw5X9Arqhy7foRDbxp7StnTURm-tdV4woioiKila_JmxNohQ1lxyaA81AyhAik26ysYEZVEJpWSThFjz-NCDmBVt5X3tIH7dM-gI1NAsoDzk0W8AgdiDQWEwn1k__uj5AtHdVkFjPmsxReUFzEGPjBJUFrTTW1zOLQllgZJ-oCJB7k7FVN_YjP1V3N53E_3ZgpfR7hpYibbar93OxYLElSpA&src-supplier=Analog+Devices; ComponentLink4URL: https://datasheet.octopart.com:443/ADXL375BCCZ-RL7-Analog-Devices-datasheet-20674032.pdf?src-supplier=Analog+Devices; ComponentLink4Description: https://datasheet.octopart.com:443/ADXL375BCCZ-RL7-Analog-Devices-datasheet-20674032.pdf?src-supplier=Analog+Devices; ComponentLink5URL: https://datasheet.octopart.com:443/ADXL375BCCZ-RL7-Analog-Devices-datasheet-17332620.pdf?src-supplier=Analog+Devices; ComponentLink5Description: https://datasheet.octopart.com:443/ADXL375BCCZ-RL7-Analog-Devices-datasheet-17332620.pdf?src-supplier=Analog+Devices; ComponentLink6URL: https://datasheet.octopart.com:443/ADXL375BCCZ-RL7-Analog-Devices-datasheet-165827030.pdf?src-supplier=element14+APAC; ComponentLink6Description: https://datasheet.octopart.com:443/ADXL375BCCZ-RL7-Analog-Devices-datasheet-165827030.pdf?src-supplier=element14+APAC; ComponentLink7URL: http://sigma.octopart.com:80/conflict_mineral_statement/Analog-Devices-company-33.pdf?src-supplier=Compliance+Statements; ComponentLink7Description: http://sigma.octopart.com:80/conflict_mineral_statement/Analog-Devices-company-33.pdf?src-supplier=Compliance+Statements; ComponentLink8URL: https://octopart.com:443/opatz8j6/c1?t=rrkhkGPMjP7Iqnly7j9fdZ3o0RKgMiFkQPZMKbQbflJH--ggn13ri6nr_qoLoVMBpcjMsLuBtCN49j0RsZIoHqFD1kJUG9JuBPBVbRduVapR_ewwugjojTiNN3yLkHfsLl0bNk-eQFqtbX2ur4W2RAEfWZ7Ia_jJXVQqEje7Qe3hZpTAyumUSu6k56QI7byZ6hhDN9TYorEiHcCBnp2owL7n_reby6yXnIcmds1MrI-dxLJFVmAyu8Aezh2W6njhBZ_kNSSabPsoIz0Y_WQ7WW8OHftr-BLWyukyQKzirtU7K6zjNiW53g&src-supplier=Compliance+Statements; ComponentLink8Description: https://octopart.com:443/opatz8j6/c1?t=rrkhkGPMjP7Iqnly7j9fdZ3o0RKgMiFkQPZMKbQbflJH--ggn13ri6nr_qoLoVMBpcjMsLuBtCN49j0RsZIoHqFD1kJUG9JuBPBVbRduVapR_ewwugjojTiNN3yLkHfsLl0bNk-eQFqtbX2ur4W2RAEfWZ7Ia_jJXVQqEje7Qe3hZpTAyumUSu6k56QI7byZ6hhDN9TYorEiHcCBnp2owL7n_reby6yXnIcmds1MrI-dxLJFVmAyu8Aezh2W6njhBZ_kNSSabPsoIz0Y_WQ7WW8OHftr-BLWyukyQKzirtU7K6zjNiW53g&src-supplier=Compliance+Statements; ComponentLink9Description: Tedarikçi; ComponentLink9URL: https://www.digikey.com/en/products/detail/analog-devices-inc/ADXL375BCCZ/4376342
U10 = MAX3232IPWR: IC, Transceiver, RS232 (2)Transmitters/(2)Receivers, 250Kbit, TSSOP-16, -40C to +85C; Manufacturer: Texas Instruments; Manufacturer Lifecycle Status: ACTIVE; Data Rate: 250kbps; Logic Function: Receiver, Transceiver; Max Supply Voltage: 5.5V; Min Supply Voltage: 3V; Nominal Supply Current: 1mA; Number of Channels: 2; Number of Transceivers: 1; Operating Supply Voltage: 5V; Simplex/Duplex: Full Duplex; Supplier: Mouser; Supplier Part Number: 595-MAX3232IPWR; Manufacturer Part Number: MAX3232IPWR; RoHS: Compliant; Category: Interface ICs; Stock: 28054; Pricing: 1=1,01, 10=0,727, 50=0,655, 100=0,576, 1000=0,497, 10000=0,453 (USD); Case/Package: TSSOP; Height: 1.2mm; Lead Free: Lead Free; Length: 5mm; Lifecycle Status: Production; Max Operating Temperature: 85°C; Min Operating Temperature: -40°C; Mounting Technology: Surface Mount; Number of Drivers: 2; Pins: 16; Number of Receivers: 2; Number of Transmitters: 2; Operating Supply Current: 1mA; Packaging: Tape & Reel; Radiation Hardening: No; REACH SVHC: No; Schedule B: 8542390000, 8542390000|8542390000|8542390000|8542390000|8542390000; Thickness: 1mm; Weight: 61.887009mg; Width: 4.4mm; ComponentLink1URL: https://sigma.octopart.com:443/189718192/technical_drawing/Texas-Instruments-MAX3232IPWR.pdf?src-supplier=Texas+Instruments; ComponentLink1Description: https://sigma.octopart.com:443/189718192/technical_drawing/Texas-Instruments-MAX3232IPWR.pdf?src-supplier=Texas+Instruments; ComponentLink2URL: https://octopart.com:443/opatz8j6/c1?t=rNJkzVGHD8QDESG7XFNYsykgZEXUadFzzSMEgguNs1rZGPxKglcLcGakB1eP8ry9gbz37LCUPk4Or5ulQnPuUz3Y22sGolGdcJPpgEWnA8Cb41z-NyDpToWMZW0KsUvePjnzuBHDzGTKjcgNB-yr4Cl0kQf1s50b8VLI24CtTbroaGwR9zj9CxwfzApYZs7CQrSoI-cD-RxlcwOcRTkpTVjrq9Zdbk9vWa-ku9GiiqC5h0p_j6VvlpHTPx-rg0uH67WRaBHzhkyD_ylEnYOIEJ7swG900WshtT5QNVrZijW_U1PZghQYJbR9hvJzOqeaBLMD45U-x6SDBL7Unmks7BGFJYqn6QeZmJAnSMHKUihIxthuN9Zi6Y2aPs9zcrZCKwix&src-supplier=Texas+Instruments; ComponentLink2Description: https://octopart.com:443/opatz8j6/c1?t=rNJkzVGHD8QDESG7XFNYsykgZEXUadFzzSMEgguNs1rZGPxKglcLcGakB1eP8ry9gbz37LCUPk4Or5ulQnPuUz3Y22sGolGdcJPpgEWnA8Cb41z-NyDpToWMZW0KsUvePjnzuBHDzGTKjcgNB-yr4Cl0kQf1s50b8VLI24CtTbroaGwR9zj9CxwfzApYZs7CQrSoI-cD-RxlcwOcRTkpTVjrq9Zdbk9vWa-ku9GiiqC5h0p_j6VvlpHTPx-rg0uH67WRaBHzhkyD_ylEnYOIEJ7swG900WshtT5QNVrZijW_U1PZghQYJbR9hvJzOqeaBLMD45U-x6SDBL7Unmks7BGFJYqn6QeZmJAnSMHKUihIxthuN9Zi6Y2aPs9zcrZCKwix&src-supplier=Texas+Instruments; ComponentLink3URL: https://sigma.octopart.com:443/116621398/technical_drawing/Texas-Instruments-MAX3232IPWR.pdf?src-supplier=Texas+Instruments; ComponentLink3Description: https://sigma.octopart.com:443/116621398/technical_drawing/Texas-Instruments-MAX3232IPWR.pdf?src-supplier=Texas+Instruments; ComponentLink4URL: https://datasheet.octopart.com:443/MAX3232IPWR-Texas-Instruments-datasheet-41216554.pdf?src-supplier=Texas+Instruments; ComponentLink4Description: https://datasheet.octopart.com:443/MAX3232IPWR-Texas-Instruments-datasheet-41216554.pdf?src-supplier=Texas+Instruments; ComponentLink5URL: https://datasheet.octopart.com:443/MAX3232IPWR-Texas-Instruments-datasheet-36834620.pdf?src-supplier=Texas+Instruments; ComponentLink5Description: https://datasheet.octopart.com:443/MAX3232IPWR-Texas-Instruments-datasheet-36834620.pdf?src-supplier=Texas+Instruments; ComponentLink6URL: https://datasheet.octopart.com:443/MAX3232IPWR-Texas-Instruments-datasheet-22123331.pdf?src-supplier=Texas+Instruments; ComponentLink6Description: https://datasheet.octopart.com:443/MAX3232IPWR-Texas-Instruments-datasheet-22123331.pdf?src-supplier=Texas+Instruments; ComponentLink7URL: https://datasheet.octopart.com:443/MAX3232IPWR-Texas-Instruments-datasheet-11828648.pdf?src-supplier=Texas+Instruments; ComponentLink7Description: https://datasheet.octopart.com:443/MAX3232IPWR-Texas-Instruments-datasheet-11828648.pdf?src-supplier=Texas+Instruments; ComponentLink8URL: https://datasheet.octopart.com:443/MAX3232IPWR-Texas-Instruments-datasheet-10670759.pdf?src-supplier=Texas+Instruments; ComponentLink8Description: https://datasheet.octopart.com:443/MAX3232IPWR-Texas-Instruments-datasheet-10670759.pdf?src-supplier=Texas+Instruments; ComponentLink9URL: https://datasheet.octopart.com:443/MAX3232IPWR-Texas-Instruments-datasheet-10254354.pdf?src-supplier=Texas+Instruments; ComponentLink9Description: https://datasheet.octopart.com:443/MAX3232IPWR-Texas-Instruments-datasheet-10254354.pdf?src-supplier=Texas+Instruments; ComponentLink10URL: https://sigma.octopart.com:443/49249815/technical_drawing/Texas-Instruments-MAX3232IPWR.pdf?src-supplier=Texas+Instruments; ComponentLink10Description: https://sigma.octopart.com:443/49249815/technical_drawing/Texas-Instruments-MAX3232IPWR.pdf?src-supplier=Texas+Instruments; ComponentLink11URL: https://datasheet.octopart.com:443/MAX3232IPWR-Texas-Instruments-datasheet-8828700.pdf?src-supplier=Farnell; ComponentLink11Description: https://datasheet.octopart.com:443/MAX3232IPWR-Texas-Instruments-datasheet-8828700.pdf?src-supplier=Farnell; ComponentLink12URL: https://datasheet.octopart.com:443/MAX3232IPWR-Texas-Instruments-datasheet-8734276.pdf?src-supplier=Farnell; ComponentLink12Description: https://datasheet.octopart.com:443/MAX3232IPWR-Texas-Instruments-datasheet-8734276.pdf?src-supplier=Farnell; ComponentLink13URL: https://datasheet.octopart.com:443/MAX3232IPWR-Texas-Instruments-datasheet-8527338.pdf?src-supplier=Farnell; ComponentLink13Description: https://datasheet.octopart.com:443/MAX3232IPWR-Texas-Instruments-datasheet-8527338.pdf?src-supplier=Farnell; ComponentLink14URL: https://datasheet.octopart.com:443/MAX3232IPWR-Texas-Instruments-datasheet-611903.pdf?src-supplier=Farnell; ComponentLink14Description: https://datasheet.octopart.com:443/MAX3232IPWR-Texas-Instruments-datasheet-611903.pdf?src-supplier=Farnell; ComponentLink15URL: https://datasheet.octopart.com:443/MAX3232IPWR-Texas-Instruments-datasheet-37563965.pdf?src-supplier=Farnell; ComponentLink15Description: https://datasheet.octopart.com:443/MAX3232IPWR-Texas-Instruments-datasheet-37563965.pdf?src-supplier=Farnell; ComponentLink16URL: https://datasheet.octopart.com:443/MAX3232IPWR-Texas-Instruments-datasheet-26576805.pdf?src-supplier=Farnell; ComponentLink16Description: https://datasheet.octopart.com:443/MAX3232IPWR-Texas-Instruments-datasheet-26576805.pdf?src-supplier=Farnell; ComponentLink17URL: https://datasheet.octopart.com:443/MAX3232IPWR-Texas-Instruments-datasheet-23768451.pdf?src-supplier=Farnell; ComponentLink17Description: https://datasheet.octopart.com:443/MAX3232IPWR-Texas-Instruments-datasheet-23768451.pdf?src-supplier=Farnell; ComponentLink18URL: https://datasheet.octopart.com:443/MAX3232IPWR.-Texas-Instruments-datasheet-62342776.pdf?src-supplier=element14+APAC; ComponentLink18Description: https://datasheet.octopart.com:443/MAX3232IPWR.-Texas-Instruments-datasheet-62342776.pdf?src-supplier=element14+APAC; ComponentLink19URL: https://datasheet.octopart.com:443/MAX3232IPWR.-Texas-Instruments-datasheet-62088785.pdf?src-supplier=element14+APAC; ComponentLink19Description: https://datasheet.octopart.com:443/MAX3232IPWR.-Texas-Instruments-datasheet-62088785.pdf?src-supplier=element14+APAC; ComponentLink20URL: https://datasheet.octopart.com:443/MAX3232IPWR-Texas-Instruments-datasheet-14436492.pdf?src-supplier=Future+Electronics; ComponentLink20Description: https://datasheet.octopart.com:443/MAX3232IPWR-Texas-Instruments-datasheet-14436492.pdf?src-supplier=Future+Electronics; ComponentLink21URL: https://datasheet.octopart.com:443/MAX3232IPWR-Texas-Instruments-datasheet-137316104.pdf?src-supplier=Future+Electronics; ComponentLink21Description: https://datasheet.octopart.com:443/MAX3232IPWR-Texas-Instruments-datasheet-137316104.pdf?src-supplier=Future+Electronics; ComponentLink22URL: https://datasheet.octopart.com:443/MAX3232IPWR-Texas-Instruments-datasheet-165804188.pdf?src-supplier=LCSC; ComponentLink22Description: https://datasheet.octopart.com:443/MAX3232IPWR-Texas-Instruments-datasheet-165804188.pdf?src-supplier=LCSC; ComponentLink23URL: https://datasheet.octopart.com:443/MAX3232IPWR-Texas-Instruments-datasheet-159115493.pdf?src-supplier=LCSC; ComponentLink23Description: https://datasheet.octopart.com:443/MAX3232IPWR-Texas-Instruments-datasheet-159115493.pdf?src-supplier=LCSC; ComponentLink24URL: https://datasheet.octopart.com:443/MAX3232IPWR-Texas-Instruments-datasheet-164415690.pdf?src-supplier=SHENGYU+ELECTRONICS; ComponentLink24Description: https://datasheet.octopart.com:443/MAX3232IPWR-Texas-Instruments-datasheet-164415690.pdf?src-supplier=SHENGYU+ELECTRONICS; ComponentLink25URL: https://datasheet.octopart.com:443/MAX3232IPWR-Texas-Instruments-datasheet-20860975.pdf?src-supplier=Newark; ComponentLink25Description: https://datasheet.octopart.com:443/MAX3232IPWR-Texas-Instruments-datasheet-20860975.pdf?src-supplier=Newark; ComponentLink26URL: https://datasheet.octopart.com:443/MAX3232IPWR-Texas-Instruments-datasheet-14121419.pdf?src-supplier=iiiC; ComponentLink26Description: https://datasheet.octopart.com:443/MAX3232IPWR-Texas-Instruments-datasheet-14121419.pdf?src-supplier=iiiC; ComponentLink27URL: https://datasheet.octopart.com:443/MAX3232IPWR-Texas-Instruments-datasheet-10502933.pdf?src-supplier=Jameco; ComponentLink27Description: https://datasheet.octopart.com:443/MAX3232IPWR-Texas-Instruments-datasheet-10502933.pdf?src-supplier=Jameco; ComponentLink28URL: https://datasheet.octopart.com:443/MAX3232IPWR-Texas-Instruments-datasheet-153559.pdf?src-supplier=Mouser; ComponentLink28Description: https://datasheet.octopart.com:443/MAX3232IPWR-Texas-Instruments-datasheet-153559.pdf?src-supplier=Mouser; ComponentLink29URL: https://datasheet.octopart.com:443/MAX3232IPWR-Texas-Instruments-datasheet-5793.pdf?src-supplier=DigiKey; ComponentLink29Description: https://datasheet.octopart.com:443/MAX3232IPWR-Texas-Instruments-datasheet-5793.pdf?src-supplier=DigiKey; ComponentLink30URL: http://sigma.octopart.com:80/reach_statement/Texas-Instruments-company-64.pdf?src-supplier=Compliance+Statements; ComponentLink30Description: http://sigma.octopart.com:80/reach_statement/Texas-Instruments-company-64.pdf?src-supplier=Compliance+Statements; ComponentLink31URL: http://sigma.octopart.com:80/conflict_mineral_statement/Texas-Instruments-company-63.pdf?src-supplier=Compliance+Statements; ComponentLink31Description: http://sigma.octopart.com:80/conflict_mineral_statement/Texas-Instruments-company-63.pdf?src-supplier=Compliance+Statements; ComponentLink32Description: Tedarikçi; ComponentLink32URL: https://www.ozdisan.com/p/driver-receiver-ve-transceiver-entegreleri-229/texas-max3232ipwr-359678
U11 = E22-900M30S: EBYTE Sx1262 E22-900M30S 850 - 930 MHZ 30Dbm Lora Modül 12Km; Communication interface: SPI; Test distance: 12000m; Air data rate: 0.018k~300kbps; Working frequency: 850~930 MHz; Receiving sensitivity: -150 dBm; ComponentLink1Description: Tedarikçi; ComponentLink1URL: https://www.f1depo.com/urun/ebyte-sx1262-e22-900m30s-850-930-mhz-30dbm-lora-modul-12km; Size: 24 * 38.5 mm; Transmitting power: 30 dBm